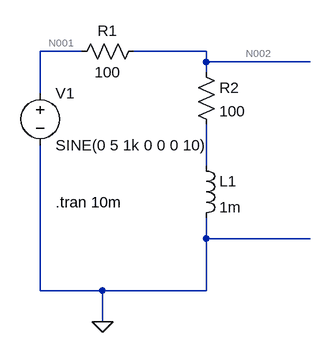
[diagram p0: schematic Assignment 2.asc]
Assignment 2.asc, the LTspice schematic file:
Version 4
SHEET 1 880 680
WIRE 96 48 32 48
WIRE 288 48 176 48
WIRE 288 64 288 48
WIRE 448 64 288 64
WIRE 288 80 288 64
WIRE 32 112 32 48
WIRE 288 224 288 160
WIRE 288 336 288 304
WIRE 448 336 288 336
WIRE 32 416 32 192
WIRE 128 416 32 416
WIRE 288 416 288 336
WIRE 288 416 128 416
WIRE 128 464 128 416
FLAG 128 464 0
SYMBOL voltage 32 96 R0
WINDOW 123 0 0 Left 0
WINDOW 39 0 0 Left 0
SYMATTR InstName V1
SYMATTR Value SINE(0 5 1k 0 0 0 10)
SYMBOL res 192 32 R90
WINDOW 0 0 56 VBottom 2
WINDOW 3 32 56 VTop 2
SYMATTR InstName R1
SYMATTR Value 100
SYMBOL res 272 64 R0
SYMATTR InstName R2
SYMATTR Value 100
SYMBOL ind 272 208 R0
SYMATTR InstName L1
SYMATTR Value 1m
TEXT 56 280 Left 2 !.tran 10m

The netlist it stands for:
* Assignment 2.asc
V1 N001 0 SINE(0 5 1k 0 0 0 10)
R1 N002 N001 100
R2 N002 N003 100
L1 N003 0 1m
.tran 10m
.backanno
.end

* Results of the author's LTspice run, read from the files saved beside the schematic
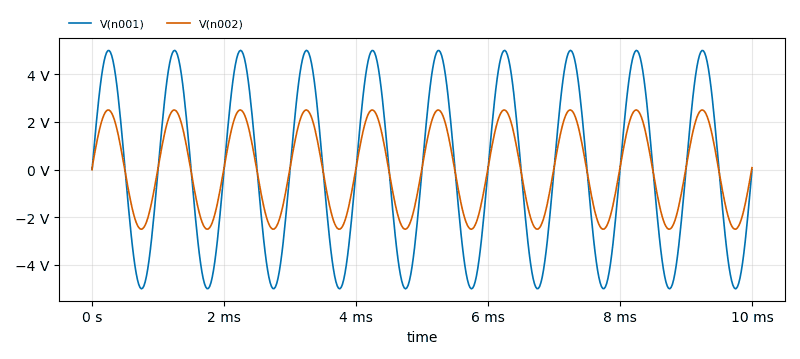
[diagram p1: Transient Analysis of Assignment 2.asc, plotted from the saved traces]
* Transient Analysis, 1 run:
*   V(n001): min -5 V, max 5 V, average -1.727 µV, rms 3.536 V, last 0 V
*   V(n002): min -2.501 V, max 2.501 V, average -41.36 µV, rms 1.769 V, last 78.47 mV